# EAGLE schematic Block Diagram (EAGLE 9.2.2)
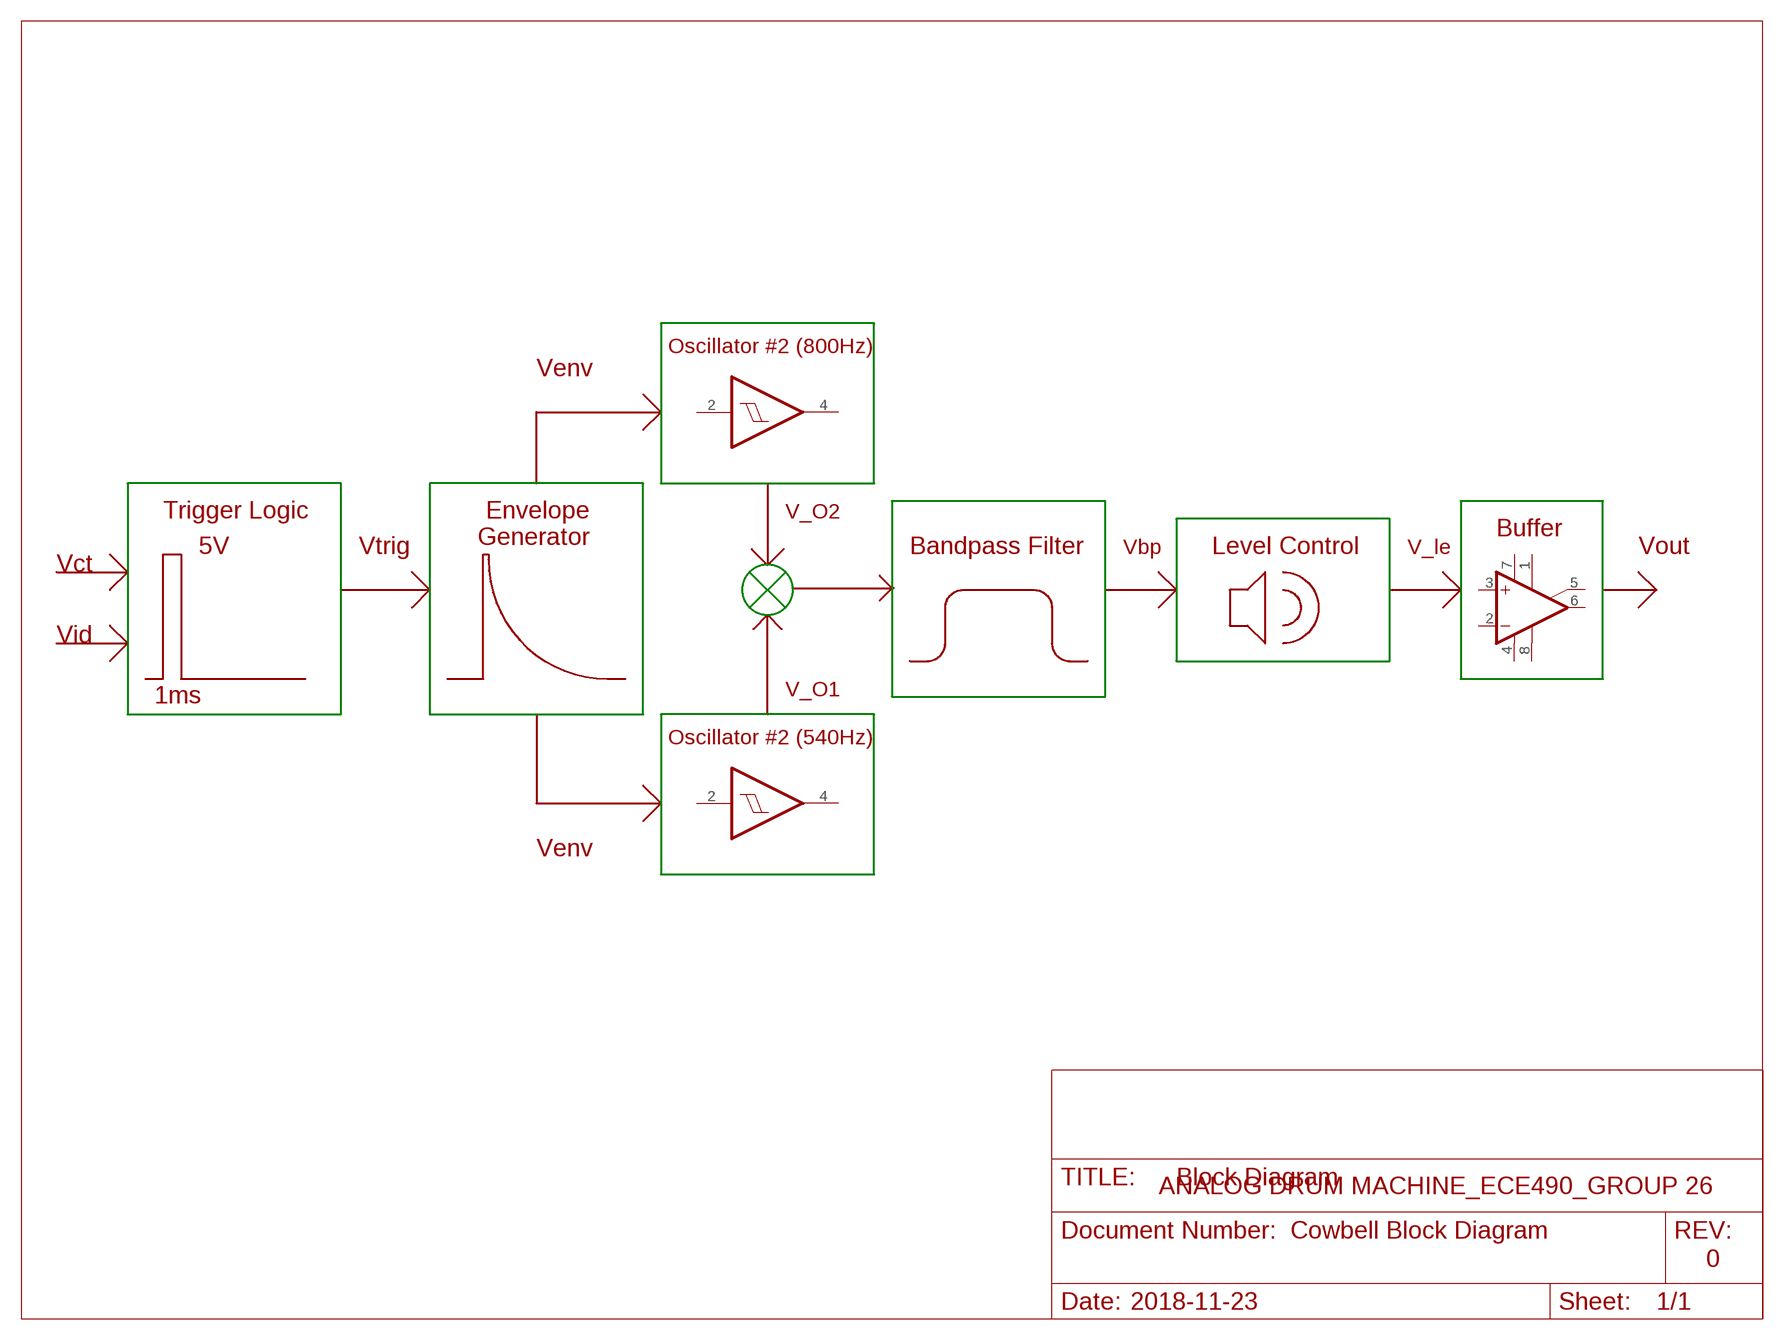
[diagram p0: schematic, sheet 1]

## Parts
IC1  74AUC1G17DBV  [SOT23-5]
IC2  74AUC1G17DBV  [SOT23-5]
IC3  LM741D  [SO08]
Unconnected: IC1.2(I) IC1.4(O) IC2.2(I) IC2.4(O) IC3.1(ON1) IC3.2(-IN) IC3.3(+IN) IC3.5(ON2) IC3.6(OUT) IC3.8(OPT)

## Notes on the sheet
- Oscillator #2 (800Hz)
- Venv
- Envelope
  Generator
- Trigger Logic | V_O2
- Buffer
- 5V | Vtrig | Bandpass Filter | Vbp | Level Control | V_le | Vout
- Vct
- Vid
- V_O1
- 1ms
- Oscillator #2 (540Hz)
- Venv
- ANALOG DRUM MACHINE_ECE490_GROUP 26
- Cowbell Block Diagram
- 0
- 2018-11-23

## Power pins joined to a net without a drawn wire
GND: IC1.3(GND) IC2.3(GND)
V+: IC3.7(V+)
V-: IC3.4(V-)
VCC: IC1.5(VCC) IC2.5(VCC)

## Library data of the parts
IC1 IC2 = 74xx-little-us:74*1G17: Single Schmitt-Trigger Buffer
IC3 = linear:*741: OP AMP